# EAGLE schematic soundmeter (EAGLE 7.3.0)
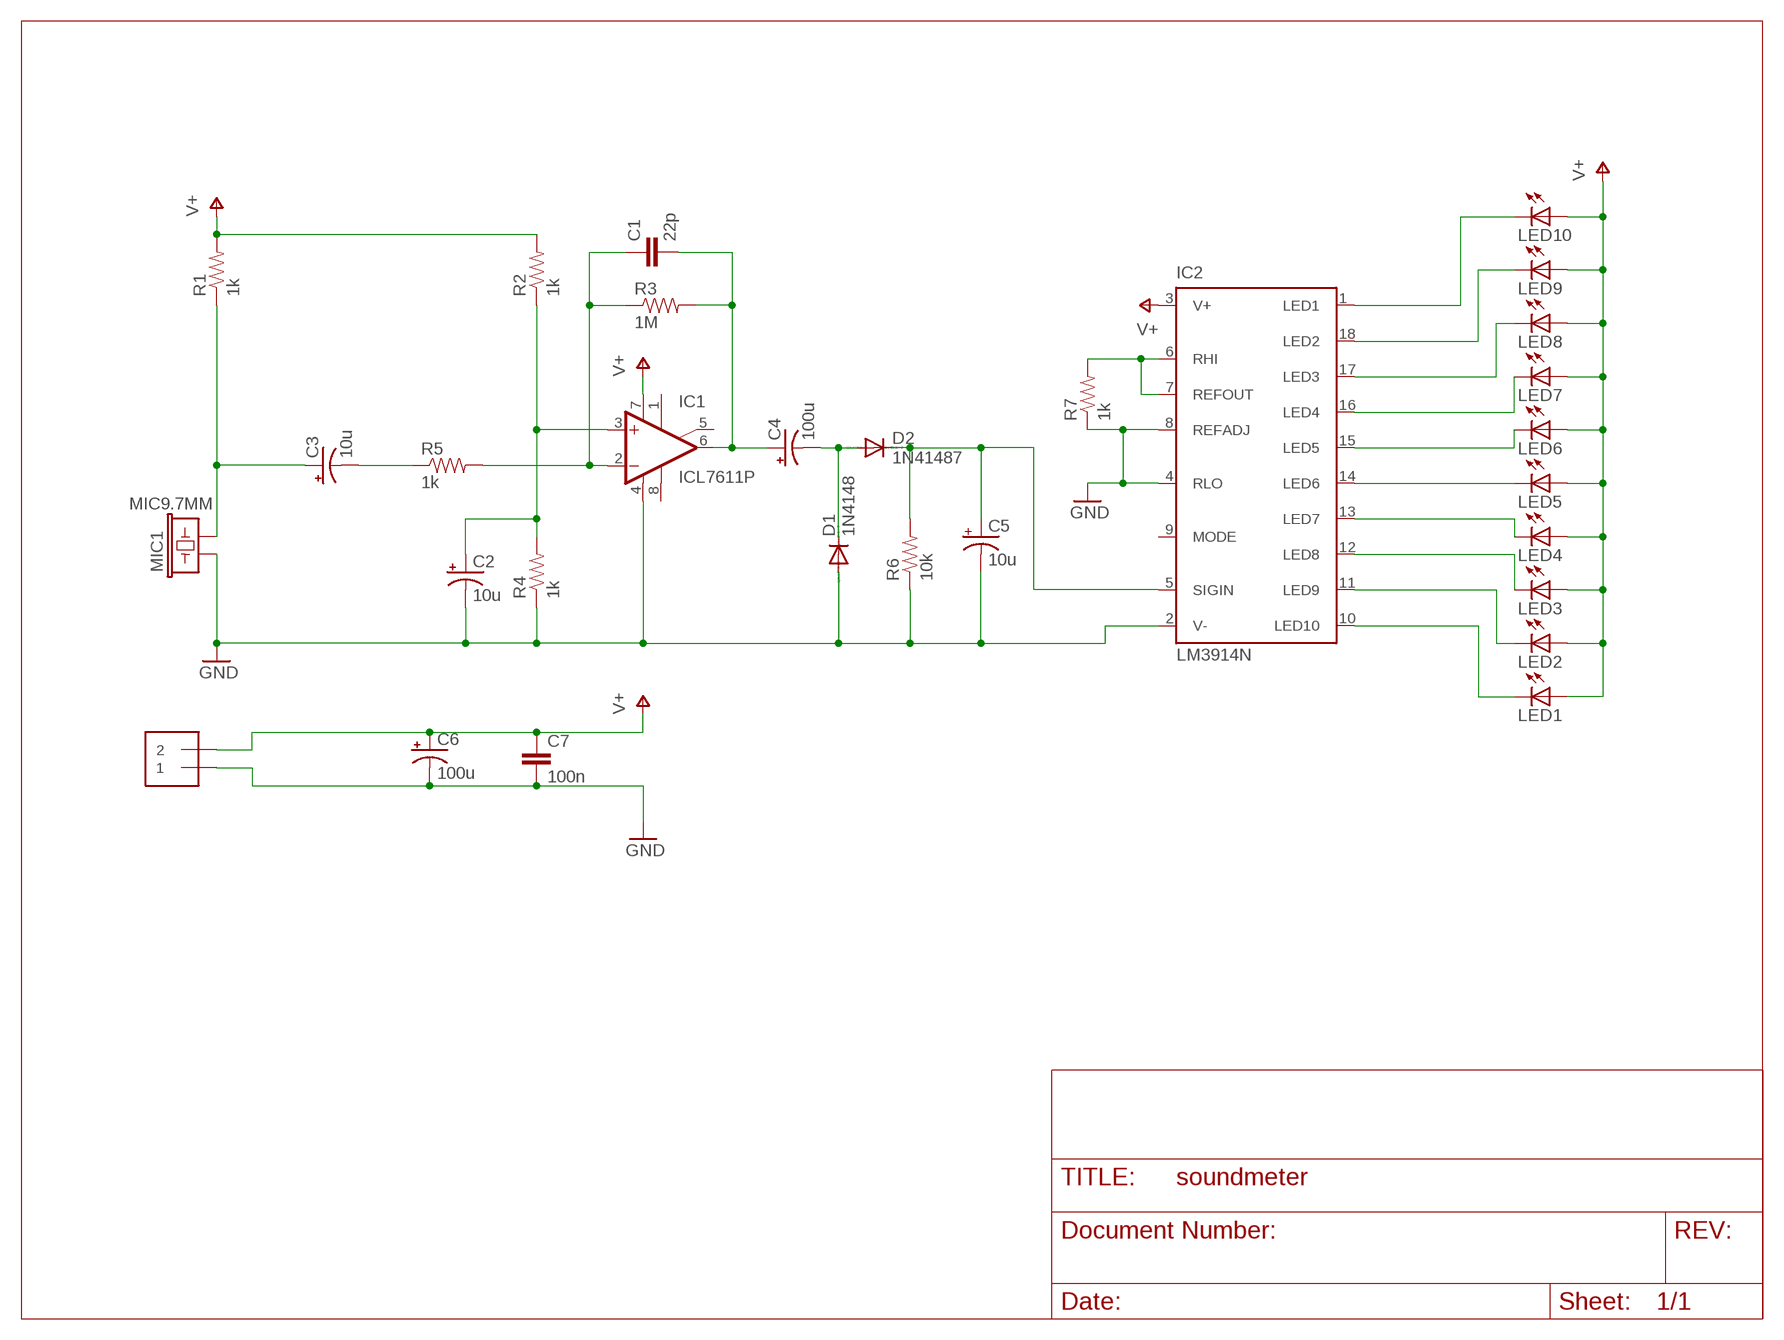
[diagram p0: schematic, sheet 1]

## Parts
C1  22p  CAPPTH  [CAP-PTH-SMALL]
C2  10u  CAP_POLPTH2  [CPOL-RADIAL-10UF-25V]
C3  10u  CAP_POLPTH2  [CPOL-RADIAL-10UF-25V]
C4  100u  CAP_POLPTH2  [CPOL-RADIAL-10UF-25V]
C5  10u  CAP_POLPTH2  [CPOL-RADIAL-10UF-25V]
C6  100u  CAP_POLPTH2  [CPOL-RADIAL-10UF-25V]
C7  100n  CAPPTH  [CAP-PTH-SMALL]
D1  1N4148  1N4148DO35-7  [DO35-7]
D2  1N41487  1N4148DO35-7  [DO35-7]
IC1  ICL7611P  [DIL08]
IC2  LM3914N  [DIL18]
J1  1X2-3.5MM  [1X2-3.5MM]
LED1  LED3MM  [LED3MM]
LED2  LED3MM  [LED3MM]
LED3  LED3MM  [LED3MM]
LED4  LED3MM  [LED3MM]
LED5  LED3MM  [LED3MM]
LED6  LED3MM  [LED3MM]
LED7  LED3MM  [LED3MM]
LED8  LED3MM  [LED3MM]
LED9  LED3MM  [LED3MM]
LED10  LED3MM  [LED3MM]
MIC1  MIC9.7MM  [MIC-9.7MM]
R1  1k  RESISTORPTH-1/4W  [AXIAL-0.4]
R2  1k  RESISTORPTH-1/4W  [AXIAL-0.4]
R3  1M  RESISTORPTH-1/4W  [AXIAL-0.4]
R4  1k  RESISTORPTH-1/4W  [AXIAL-0.4]
R5  1k  RESISTORPTH-1/4W  [AXIAL-0.4]
R6  10k  RESISTORPTH-1/4W  [AXIAL-0.4]
R7  1k  RESISTORPTH-1/4W  [AXIAL-0.4]

## Nets
GND: C2.2(-) C5.2(-) C6.2(-) C7.2 D1.A IC1.4(V-) IC2.2(V-) IC2.4(RLO) IC2.8(REFADJ) J1.1 MIC1.1 R4.P$1 R6.P$1 R7.P$1
N$1: C3.1(+) MIC1.2 R1.P$1
N$2: C3.2(-) R5.P$1
N$3: IC2.1(LED1) LED10.K(C)
N$4: C2.1(+) IC1.3(+IN) R2.P$1 R4.P$2
N$5: C1.1 IC1.2(-IN) R3.P$1 R5.P$2
N$6: C1.2 C4.1(+) IC1.6(OUT) R3.P$2
N$7: IC2.18(LED2) LED9.K(C)
N$8: IC2.17(LED3) LED8.K(C)
N$9: C4.2(-) D1.C D2.A
N$10: C5.1(+) D2.C IC2.5(SIGIN) R6.P$2
N$11: IC2.16(LED4) LED7.K(C)
N$12: IC2.15(LED5) LED6.K(C)
N$13: IC2.6(RHI) IC2.7(REFOUT) R7.P$2
N$14: IC2.14(LED6) LED5.K(C)
N$15: IC2.13(LED7) LED4.K(C)
N$16: IC2.12(LED8) LED3.K(C)
N$17: IC2.11(LED9) LED2.K(C)
N$18: IC2.10(LED10) LED1.K(C)
V+: C6.1(+) C7.1 IC1.7(V+) IC2.3(V+) J1.2 LED1.A LED2.A LED3.A LED4.A LED5.A LED6.A LED7.A LED8.A LED9.A LED10.A R1.P$2 R2.P$2
Unconnected: IC1.1(ON1) IC1.5(ON2) IC1.8(OPT) IC2.9(MODE)

## Library data of the parts
C1 C7 = SparkFun-Capacitors:CAP: Capacitor Standard 0603 ceramic capacitor, and 0.1" leaded capacitor.
C2-C6 = SparkFun-Capacitors:CAP_POL: Capacitor Polarized These are standard SMD and PTH capacitors. Normally 10uF, 47uF, and 100uF in electrolytic and tantalum varieties. Always verify the external diameter of the through hole cap, it varies with capacity, voltage, and manufacturer. The EIA devices should be standard.
D1 D2 = diode:1N4148: DIODE high speed (Philips)
IC1 = linear:ICL7611: OP AMP
IC2 = national-semiconductor:LM391: Dot/Bar Display Driver Source: Data sheet LM3915 <http://www.national.com/ds/LM/LM3915.pdf> Data sheet LM3914 <http://www.national.com/ds/LM/LM3914.pdf>
J1 = adafruit:1X2: 3.5mm Terminal block http://www.ladyada.net/library/pcb/eaglelibrary.html
LED1-LED10 = led:LED: LED OSRAM: - CHIPLED LG R971, LG N971, LY N971, LG Q971, LY Q971, LO R971, LY R971 LH N974, LH R974 LS Q976, LO Q976, LY Q976 LO Q996 - Hyper CHIPLED LW Q18S LB Q993, LB Q99A, LB R99A - SideLED LS A670, LO A670, LY A670, LG A670, LP A670 LB A673, LV A673, LT A673, LW A673 LH A674 LY A675 LS A676, LA A676, LO A676, LY A676, LW A676 LS A679, LY A679, LG A679 - Hyper Micro SIDELED® LS Y876, LA Y876, LO Y876, LY Y876 LT Y87S - SmartLED LW L88C, LW L88S LB L89C, LB L89S, LG L890 LS L89K, LO L89K, LY L89K LS L896, LA L896, LO L896, LY L896 - TOPLED LS T670, LO T670, LY T670, LG T670, LP T670 LSG T670, LSP T670, LSY T670, LOP T670, LYG T670 LG T671, LOG T671, LSG T671 LB T673, LV T673, LT T673, LW T673 LH T674 LS T676, LA T676, LO T676, LY T676, LB T676, LH T676, LSB T676, LW T676 LB T67C, LV T67C, LT T67C, LS T67K, LO T67K, LY T67K, LW E67C LS E67B, LA E67B, LO E67B, LY E67B, LB E67C, LV E67C, LT E67C LW T67C LS T679, LY T679, LG T679 LS T770, LO T770, LY T770, LG T770, LP T770 LB T773, LV T773, LT T773, LW T773 LH T774 LS E675, LA E675, LY E675, LS T675 LS T776, LA T776, LO T776, LY T776, LB T776 LHGB T686 LT T68C, LB T68C - Hyper Mini TOPLED® LB M676 - Mini TOPLED Santana® LG M470 LS M47K, LO M47K, LY M47K Source: http://www.osram.convergy.de LUXEON: - LUMILED® LXK2-PW12-R00, LXK2-PW12-S00, LXK2-PW14-U00, LXK2-PW14-V00 LXK2-PM12-R00, LXK2-PM12-S00, LXK2-PM14-U00 LXK2-PE12-Q00, LXK2-PE12-R00, LXK2-PE12-S00, LXK2-PE14-T00, LXK2-PE14-U00 LXK2-PB12-K00, LXK2-PB12-L00, LXK2-PB12-M00, LXK2-PB14-N00, LXK2-PB14-P00, LXK2-PB14-Q00 LXK2-PR12-L00, LXK2-PR12-M00, LXK2-PR14-Q00, LXK2-PR14-R00 LXK2-PD12-Q00, LXK2-PD12-R00, LXK2-PD12-S00 LXK2-PH12-R00, LXK2-PH12-S00 LXK2-PL12-P00, LXK2-PL12-Q00, LXK2-PL12-R00 Source: www.luxeon.com KINGBRIGHT: KA-3528ASYC Source: www.kingbright.com
MIC1 = SparkFun-Sensors:MIC: Omni-directional electret microphone. 9.7mm standard diameter.; PROD_ID: COMP-08856
R1-R7 = SparkFun-Passives:RESISTOR: Resistor Basic schematic elements and footprints for 0603, 1206, and PTH resistors.